# EAGLE design EIB 2xA79026-001 large pins v1.2 (EAGLE 6.5.0)
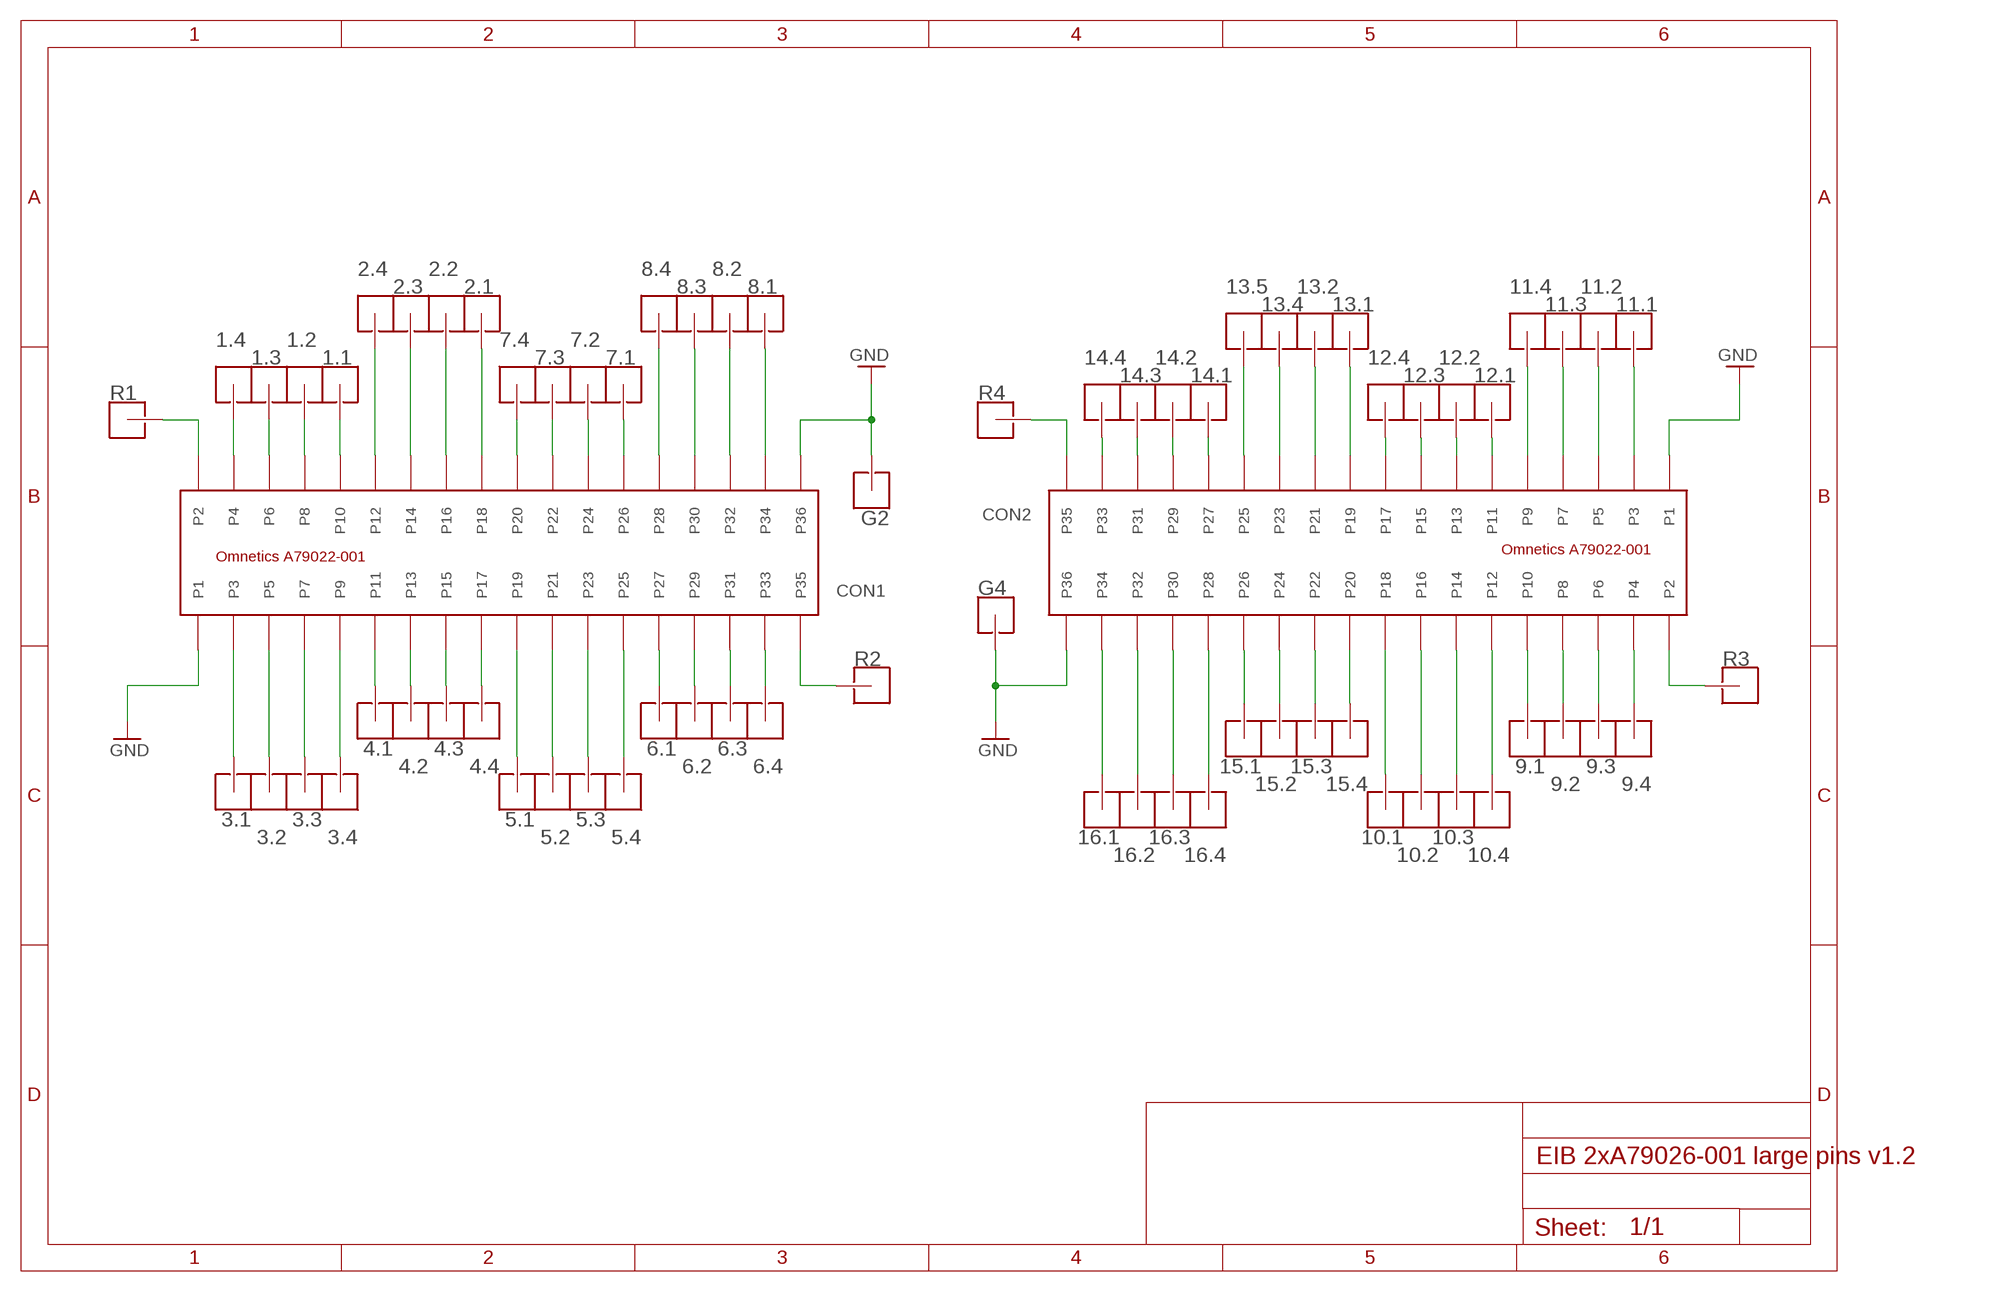
[diagram p0: schematic, sheet 1]

## Parts
1.1  HOLE_L_G_PIN_V5  [LARGE_GOLD_PIN_V5]
1.2  HOLE_L_G_PIN_V5  [LARGE_GOLD_PIN_V5]
1.3  HOLE_L_G_PIN_V5  [LARGE_GOLD_PIN_V5]
1.4  HOLE_L_G_PIN_V5  [LARGE_GOLD_PIN_V5]
2.1  HOLE_L_G_PIN_V5  [LARGE_GOLD_PIN_V5]
2.2  HOLE_L_G_PIN_V5  [LARGE_GOLD_PIN_V5]
2.3  HOLE_L_G_PIN_V5  [LARGE_GOLD_PIN_V5]
2.4  HOLE_L_G_PIN_V5  [LARGE_GOLD_PIN_V5]
3.1  HOLE_L_G_PIN_V5  [LARGE_GOLD_PIN_V5]
3.2  HOLE_L_G_PIN_V5  [LARGE_GOLD_PIN_V5]
3.3  HOLE_L_G_PIN_V5  [LARGE_GOLD_PIN_V5]
3.4  HOLE_L_G_PIN_V5  [LARGE_GOLD_PIN_V5]
4.1  HOLE_L_G_PIN_V5  [LARGE_GOLD_PIN_V5]
4.2  HOLE_L_G_PIN_V5  [LARGE_GOLD_PIN_V5]
4.3  HOLE_L_G_PIN_V5  [LARGE_GOLD_PIN_V5]
4.4  HOLE_L_G_PIN_V5  [LARGE_GOLD_PIN_V5]
5.1  HOLE_L_G_PIN_V5  [LARGE_GOLD_PIN_V5]
5.2  HOLE_L_G_PIN_V5  [LARGE_GOLD_PIN_V5]
5.3  HOLE_L_G_PIN_V5  [LARGE_GOLD_PIN_V5]
5.4  HOLE_L_G_PIN_V5  [LARGE_GOLD_PIN_V5]
6.1  HOLE_L_G_PIN_V5  [LARGE_GOLD_PIN_V5]
6.2  HOLE_L_G_PIN_V5  [LARGE_GOLD_PIN_V5]
6.3  HOLE_L_G_PIN_V5  [LARGE_GOLD_PIN_V5]
6.4  HOLE_L_G_PIN_V5  [LARGE_GOLD_PIN_V5]
7.1  HOLE_L_G_PIN_V5  [LARGE_GOLD_PIN_V5]
7.2  HOLE_L_G_PIN_V5  [LARGE_GOLD_PIN_V5]
7.3  HOLE_L_G_PIN_V5  [LARGE_GOLD_PIN_V5]
7.4  HOLE_L_G_PIN_V5  [LARGE_GOLD_PIN_V5]
8.1  HOLE_L_G_PIN_V5  [LARGE_GOLD_PIN_V5]
8.2  HOLE_L_G_PIN_V5  [LARGE_GOLD_PIN_V5]
8.3  HOLE_L_G_PIN_V5  [LARGE_GOLD_PIN_V5]
8.4  HOLE_L_G_PIN_V5  [LARGE_GOLD_PIN_V5]
9.1  HOLE_L_G_PIN_V5  [LARGE_GOLD_PIN_V5]
9.2  HOLE_L_G_PIN_V5  [LARGE_GOLD_PIN_V5]
9.3  HOLE_L_G_PIN_V5  [LARGE_GOLD_PIN_V5]
9.4  HOLE_L_G_PIN_V5  [LARGE_GOLD_PIN_V5]
10.1  HOLE_L_G_PIN_V5  [LARGE_GOLD_PIN_V5]
10.2  HOLE_L_G_PIN_V5  [LARGE_GOLD_PIN_V5]
10.3  HOLE_L_G_PIN_V5  [LARGE_GOLD_PIN_V5]
10.4  HOLE_L_G_PIN_V5  [LARGE_GOLD_PIN_V5]
11.1  HOLE_L_G_PIN_V5  [LARGE_GOLD_PIN_V5]
11.2  HOLE_L_G_PIN_V5  [LARGE_GOLD_PIN_V5]
11.3  HOLE_L_G_PIN_V5  [LARGE_GOLD_PIN_V5]
11.4  HOLE_L_G_PIN_V5  [LARGE_GOLD_PIN_V5]
12.1  HOLE_L_G_PIN_V5  [LARGE_GOLD_PIN_V5]
12.2  HOLE_L_G_PIN_V5  [LARGE_GOLD_PIN_V5]
12.3  HOLE_L_G_PIN_V5  [LARGE_GOLD_PIN_V5]
12.4  HOLE_L_G_PIN_V5  [LARGE_GOLD_PIN_V5]
13.1  HOLE_L_G_PIN_V5  [LARGE_GOLD_PIN_V5]
13.2  HOLE_L_G_PIN_V5  [LARGE_GOLD_PIN_V5]
13.4  HOLE_L_G_PIN_V5  [LARGE_GOLD_PIN_V5]
13.5  HOLE_L_G_PIN_V5  [LARGE_GOLD_PIN_V5]
14.1  HOLE_L_G_PIN_V5  [LARGE_GOLD_PIN_V5]
14.2  HOLE_L_G_PIN_V5  [LARGE_GOLD_PIN_V5]
14.3  HOLE_L_G_PIN_V5  [LARGE_GOLD_PIN_V5]
14.4  HOLE_L_G_PIN_V5  [LARGE_GOLD_PIN_V5]
15.1  HOLE_L_G_PIN_V5  [LARGE_GOLD_PIN_V5]
15.2  HOLE_L_G_PIN_V5  [LARGE_GOLD_PIN_V5]
15.3  HOLE_L_G_PIN_V5  [LARGE_GOLD_PIN_V5]
15.4  HOLE_L_G_PIN_V5  [LARGE_GOLD_PIN_V5]
16.1  HOLE_L_G_PIN_V5  [LARGE_GOLD_PIN_V5]
16.2  HOLE_L_G_PIN_V5  [LARGE_GOLD_PIN_V5]
16.3  HOLE_L_G_PIN_V5  [LARGE_GOLD_PIN_V5]
16.4  HOLE_L_G_PIN_V5  [LARGE_GOLD_PIN_V5]
CON1  A79022-001_MALESMD  [A79026-001_MALE]
CON2  A79022-001_MALESMD  [A79026-001_MALE]
G2  HOLE_L_G_PIN_V5  [LARGE_GOLD_PIN_V5]
G4  HOLE_L_G_PIN_V5  [LARGE_GOLD_PIN_V5]
R1  HOLE_L_G_PIN_V5  [LARGE_GOLD_PIN_V5]
R2  HOLE_L_G_PIN_V5  [LARGE_GOLD_PIN_V5]
R3  HOLE_L_G_PIN_V5  [LARGE_GOLD_PIN_V5]
R4  HOLE_L_G_PIN_V5  [LARGE_GOLD_PIN_V5]

## Nets
GND: CON1.P1 CON1.P36 CON2.P1 CON2.P36 G2.P$1 G4.P$1
N$1: 11.2.P$1 CON2.P5
N$2: 11.3.P$1 CON2.P7
N$3: 11.4.P$1 CON2.P9
N$4: 14.4.P$1 CON2.P33
N$5: 16.2.P$1 CON2.P32
N$6: 16.1.P$1 CON2.P34
N$7: 12.1.P$1 CON2.P11
N$8: 16.3.P$1 CON2.P30
N$9: 12.4.P$1 CON2.P17
N$10: 13.1.P$1 CON2.P19
N$11: 15.4.P$1 CON2.P20
N$12: 10.4.P$1 CON2.P12
N$13: 12.2.P$1 CON2.P13
N$14: 12.3.P$1 CON2.P15
N$15: 13.2.P$1 CON2.P21
N$16: 13.4.P$1 CON2.P23
N$17: 13.5.P$1 CON2.P25
N$18: 14.1.P$1 CON2.P27
N$19: 14.2.P$1 CON2.P29
N$20: 14.3.P$1 CON2.P31
N$21: 10.1.P$1 CON2.P18
N$22: 11.1.P$1 CON2.P3
N$23: 9.4.P$1 CON2.P4
N$24: 9.3.P$1 CON2.P6
N$25: 9.2.P$1 CON2.P8
N$26: 10.3.P$1 CON2.P14
N$27: 10.2.P$1 CON2.P16
N$28: 9.1.P$1 CON2.P10
N$29: 16.4.P$1 CON2.P28
N$30: 15.1.P$1 CON2.P26
N$31: 15.3.P$1 CON2.P22
N$32: 15.2.P$1 CON2.P24
N$33: CON1.P2 R1.P$1
N$34: CON2.P2 R3.P$1
N$35: CON2.P35 R4.P$1
N$36: CON1.P35 R2.P$1
N$37: 3.2.P$1 CON1.P5
N$38: 3.3.P$1 CON1.P7
N$39: 3.4.P$1 CON1.P9
N$40: 4.1.P$1 CON1.P11
N$41: 4.2.P$1 CON1.P13
N$42: 4.3.P$1 CON1.P15
N$43: 5.2.P$1 CON1.P21
N$44: 5.3.P$1 CON1.P23
N$45: 5.4.P$1 CON1.P25
N$46: 7.4.P$1 CON1.P20
N$47: 7.3.P$1 CON1.P22
N$48: 7.2.P$1 CON1.P24
N$49: 4.4.P$1 CON1.P17
N$50: 5.1.P$1 CON1.P19
N$51: 7.1.P$1 CON1.P26
N$52: 2.1.P$1 CON1.P18
N$53: 3.1.P$1 CON1.P3
N$54: 1.4.P$1 CON1.P4
N$55: 1.3.P$1 CON1.P6
N$56: 1.2.P$1 CON1.P8
N$57: 2.4.P$1 CON1.P12
N$58: 2.3.P$1 CON1.P14
N$59: 2.2.P$1 CON1.P16
N$60: 1.1.P$1 CON1.P10
N$61: 6.4.P$1 CON1.P33
N$62: 6.1.P$1 CON1.P27
N$63: 6.2.P$1 CON1.P29
N$64: 6.3.P$1 CON1.P31
N$65: 8.1.P$1 CON1.P34
N$66: 8.2.P$1 CON1.P32
N$67: 8.3.P$1 CON1.P30
N$68: 8.4.P$1 CON1.P28

## Library data of the parts
1.1-1.4 2.1-2.4 3.1-3.4 4.1-4.4 5.1-5.4 6.1-6.4 7.1-7.4 8.1-8.4 9.1-9.4 10.1-10.4 11.1-11.4 12.1-12.4 13.1 13.2 13.4 13.5 14.1-14.4 15.1-15.4 16.1-16.4 G2 G4 R1-R4 = pin and holes:HOLE
CON1 CON2 = omnetics:A79022-001_MALE

## Board
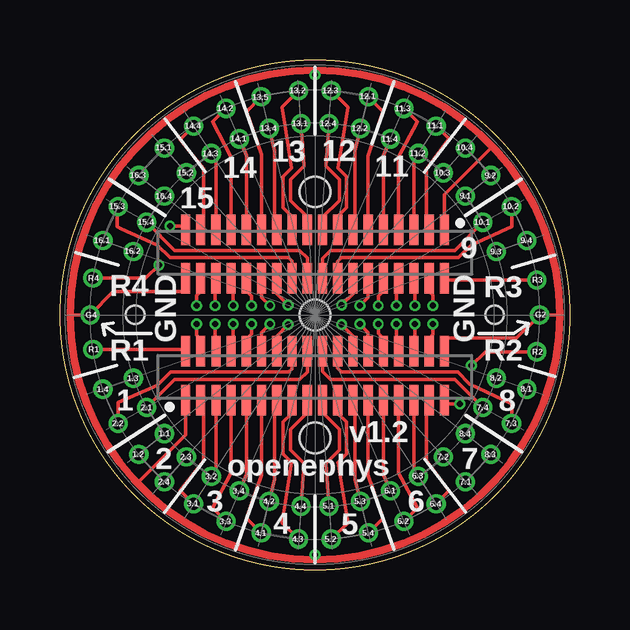
[diagram p1: board, top side]
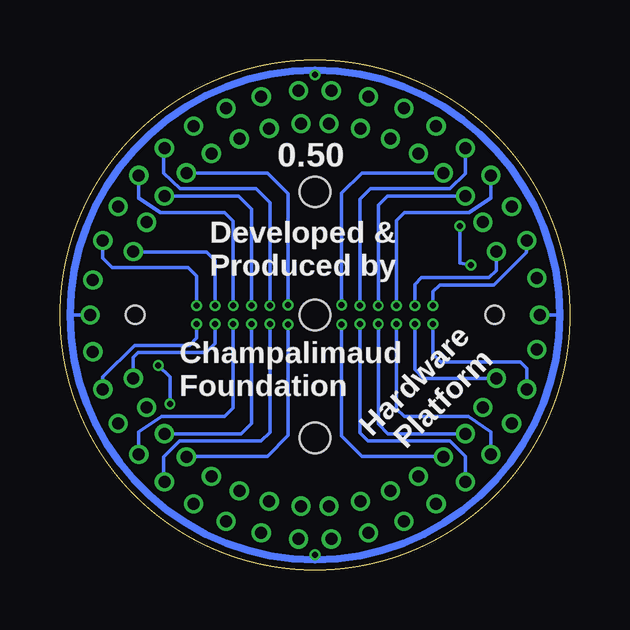
[diagram p2: board, bottom side, seen from below]

Size 21.26 x 21.26 mm. Coordinates in mm from the lower left corner, seen from the top.
Outline: circle at 10.63,10.63 radius 10.63
Copper layers (1*16): Top 0.012mm / dielectric 1.55mm / Bottom 0.012mm
Design rules "eC_2Layer_PClass8_BaseCopperO12 CHANGED": minimum track width 0.1mm, minimum drill 0.2mm, track to track 0.1mm, track to pad 0.1mm, pad to pad 0.1mm, via to via 0.1mm, smd to smd 0mil, copper to edge 0.25mm, drill to drill 0.35mm, minimum pad ring 0.1mm, minimum via ring 0.1mm, stop-mask expansion 0mil, vias tented up to drill 0.45mm, thermal gap 0.2mm
Holes 1.27 mm at 10.63,10.63 10.63,15.76 10.63,5.5
Holes 0.76 mm at 3.14,10.63 18.12,10.63

### Footprints (pad centres in the part's own frame; a part is rotated, then mirrored left to right if it is on the bottom)
LARGE_GOLD_PIN_V5 = drill 0.5 pad 0.8: P$1 0,0
A79026-001_MALE = smd 0.381 x 1.27: P1 -5.397,-1.016; P2 -5.397,1.016; P3 -4.763,-1.016; P4 -4.763,1.016; P5 -4.128,-1.016; P6 -4.128,1.016; P7 -3.493,-1.016; P8 -3.493,1.016; P9 -2.857,-1.016; P10 -2.857,1.016; P11 -2.223,-1.016; P12 -2.223,1.016; P13 -1.587,-1.016; P14 -1.587,1.016; P15 -0.953,-1.016; P16 -0.953,1.016; P17 -0.318,-1.016; P18 -0.318,1.016; P19 0.318,-1.016; P20 0.318,1.016; P21 0.953,-1.016; P22 0.953,1.016; P23 1.587,-1.016; P24 1.587,1.016; P25 2.223,-1.016; P26 2.223,1.016; P27 2.857,-1.016; P28 2.857,1.016; P29 3.493,-1.016; P30 3.493,1.016; P31 4.128,-1.016; P32 4.128,1.016; P33 4.763,-1.016; P34 4.763,1.016; P35 5.397,-1.016; P36 5.397,1.016

### Placement (x,y rotation side)
1.1  4.36,5.68 0 top
1.2  3.29,4.81 0 top
1.3  3.06,7.99 0 top
1.4  1.79,7.53 0 top
2.1  3.62,6.77 0 top
2.2  2.43,6.11 0 top
2.3  5.27,4.71 0 top
2.4  4.36,3.67 0 top
3.1  5.58,2.76 0 top
3.2  6.31,3.9 0 top
3.3  6.92,2.02 0 top
3.4  7.48,3.29 0 top
4.1  8.4,1.54 0 top
4.2  8.73,2.86 0 top
4.3  9.94,1.28 0 top
4.4  10.05,2.65 0 top
5.1  11.21,2.65 0 top
5.2  11.32,1.28 0 top
5.3  12.54,2.86 0 top
5.4  12.87,1.54 0 top
6.1  13.78,3.29 0 top
6.2  14.34,2.02 0 top
6.3  14.95,3.9 0 top
6.4  15.69,2.76 0 top
7.1  16.9,3.67 0 top
7.2  15.99,4.71 0 top
7.3  18.83,6.11 0 top
7.4  17.64,6.77 0 top
8.1  19.47,7.53 0 top
8.2  18.2,7.99 0 top
8.3  17.97,4.81 0 top
8.4  16.9,5.68 0 top
9.1  16.9,15.58 0 top
9.2  17.97,16.45 0 top
9.3  18.2,13.27 0 top
9.4  19.47,13.73 0 top
10.1  17.64,14.49 0 top
10.2  18.83,15.15 0 top
10.3  15.99,16.55 0 top
10.4  16.9,17.59 0 top
11.1  15.69,18.5 0 top
11.2  14.95,17.36 0 top
11.3  14.34,19.24 0 top
11.4  13.78,17.97 0 top
12.1  12.87,19.72 0 top
12.2  12.54,18.4 0 top
12.3  11.32,19.98 0 top
12.4  11.21,18.61 0 top
13.1  10.05,18.61 0 top
13.2  9.94,19.98 0 top
13.4  8.73,18.4 0 top
13.5  8.4,19.72 0 top
14.1  7.48,17.97 0 top
14.2  6.92,19.24 0 top
14.3  6.31,17.36 0 top
14.4  5.58,18.5 0 top
15.1  4.36,17.59 0 top
15.2  5.27,16.55 0 top
15.3  2.43,15.15 0 top
15.4  3.62,14.49 0 top
16.1  1.79,13.73 0 top
16.2  3.06,13.27 0 top
16.3  3.29,16.45 0 top
16.4  4.36,15.58 0 top
CON1  10.63,8.09 0 top
CON2  10.63,13.17 180 top
G2  20,10.63 0 top
G4  1.26,10.63 0 top
R1  1.37,9.18 0 top
R2  19.89,9.09 0 top
R3  19.89,12.08 0 top
R4  1.37,12.17 0 top

### Tracks (layer width: path | path; a pad name or v marks a point on that pad's centre or on a via)
GND  (via drill 0.25)
  Top 0.152: CON1.P1 5.25,7.06 5.25,5.63 3.24,3.62 3.21,3.62 2.2,4.84 1.33,6.41 0.93,7.53 0.52,8.85 0.41,10.63 G4.P$1 2.22,11.6 5.25,11.6 5.25,12.14 CON2.P36 | CON2.P1 16.03,15.65 18.05,17.67 18.96,16.52 19.88,15 20.43,13.47 20.79,12.05 20.84,10.63 G2.P$1 19.04,9.66 16.01,9.66 16.03,9.65 CON1.P36 | v10.63,20.64 10.63,20.84 | v10.63,0.62 10.63,0.42
  Top 0.305: 0.42,10.63 arc-90 10.63,20.84 arc-90 20.84,10.63 arc-90 10.63,0.42 arc-90 0.42,10.63
  Bottom 0.152: 20.84,10.63 G2.P$1 | G4.P$1 0.42,10.63
  Bottom 0.305: 0.42,10.63 arc-90 10.63,20.84 arc-90 20.84,10.63 arc-90 10.63,0.42 arc-90 0.42,10.63
N$1
  Top 0.152: CON2.P5 14.76,17.17 11.2.P$1
N$2
  Top 0.152: CON2.P7 14.12,17.21 14.9,18.68 11.3.P$1
N$3
  Top 0.152: CON2.P9 13.49,17.27 11.4.P$1
N$4
  Top 0.152: CON2.P33 5.98,14.3 5.98,16.73 5.02,17.95 14.4.P$1
N$5  (via drill 0.25)
  Top 0.152: CON2.P32 6.46,12.12 v6.46,11.01
  Bottom 0.152: 3.09,13.25 16.2.P$1 3.06,12.48 3.37,12.18 6.19,12.18 6.46,11.9 v6.46,11.01
N$6  (via drill 0.25)
  Top 0.152: CON2.P34 5.87,11.61 5.7,11.44 v5.7,11.01
  Bottom 0.152: 16.1.P$1 1.82,13.7 1.82,13.22 3.16,11.87 5.42,11.87 5.7,11.6 v5.7,11.01
N$7
  Top 0.152: CON2.P11 12.85,17.26 13.47,19.11 12.1.P$1
N$8  (via drill 0.25)
  Top 0.152: CON2.P30 7.23,12.06 v7.23,11.01
  Bottom 0.152: v7.23,11.01 7.23,14.57 6.9,14.9 4.2,14.9 3.29,15.51 16.3.P$1
N$9
  Top 0.152: CON2.P17 10.95,14.71 11.65,15.41 11.65,16.27 11.09,16.83 12.4.P$1
N$10
  Top 0.152: CON2.P19 10.31,14.71 9.61,15.41 9.61,16.27 10.17,16.83 13.1.P$1
N$11
  Top 0.152: CON2.P20 10.31,13.01 10,13.32 4.79,13.32 15.4.P$1
N$12  (via drill 0.25)
  Top 0.152: CON2.P12 12.85,11.35 v12.51,11.01
  Bottom 0.152: v12.51,11.01 12.51,15.3 13.09,15.89 16.24,15.89 16.93,16.55 16.93,17.56 10.4.P$1
N$13
  Top 0.152: CON2.P13 12.31,14.19 12.31,17.49 12.2.P$1
N$14
  Top 0.152: CON2.P15 11.58,14.73 11.95,15.1 11.95,16.4 11.6,16.75 11.87,18.53 12,19.29 12.3.P$1
N$15
  Top 0.152: CON2.P21 9.68,14.73 9.31,15.1 9.31,16.4 9.66,16.75 9.39,18.53 9.26,19.29 13.2.P$1
N$16
  Top 0.152: CON2.P23 8.95,14.19 8.95,17.49 13.4.P$1
N$17
  Top 0.152: CON2.P25 8.41,17.31 7.79,19.11 13.5.P$1
N$18
  Top 0.152: CON2.P27 7.77,17.27 14.1.P$1
N$19
  Top 0.152: CON2.P29 7.14,17.21 6.36,18.68 14.2.P$1
N$20
  Top 0.152: CON2.P31 6.5,17.17 14.3.P$1
N$21
  Top 0.152: CON2.P18 10.95,12.98 11.29,13.32 16.47,13.32 10.1.P$1
N$22
  Top 0.152: CON2.P3 15.28,14.3 15.28,16.7 16.22,17.97 11.1.P$1
N$23  (via drill 0.25)
  Top 0.152: CON2.P4 15.39,11.63 15.56,11.47 v15.56,11.01
  Bottom 0.152: v15.56,11.01 15.56,12.26 15.91,12.61 19.09,12.61 19.47,12.99 9.4.P$1
N$24  (via drill 0.25)
  Top 0.152: CON2.P6 14.8,12.12 v14.8,11.01
  Bottom 0.152: v14.8,11.01 14.8,12.89 15.15,13.25 18.1,13.25 9.3.P$1
N$25  (via drill 0.25)
  Top 0.152: CON2.P8 14.03,12.07 v14.03,11.01
  Bottom 0.152: v14.03,11.01 14.03,14.54 14.39,14.9 17.06,14.9 17.97,15.51 9.2.P$1
N$26  (via drill 0.25)
  Top 0.152: CON2.P14 12.22,11.51 v11.75,11.04
  Bottom 0.152: v11.75,11.04 11.75,15.68 12.61,16.55 10.3.P$1
N$27
  Top 0.152: CON2.P16 11.58,12.85 11.75,13.02 16.62,13.02 17.16,13.55 18.83,14.31 10.2.P$1
N$28  (via drill 0.25)
  Top 0.152: CON2.P10 13.49,11.63 13.27,11.42 v13.27,11.01
  Bottom 0.152: v13.27,11.01 13.27,15.05 13.81,15.58 9.1.P$1
N$29  (via drill 0.25)
  Top 0.152: CON2.P28 7.77,11.63 7.99,11.42 v7.99,11.01
  Bottom 0.152: v7.99,11.01 7.99,15.2 7.61,15.58 16.4.P$1
N$30  (via drill 0.25)
  Top 0.152: CON2.P26 8.41,11.35 v8.75,11.01
  Bottom 0.152: v8.75,11.01 8.75,15.46 8.32,15.89 4.99,15.89 4.36,16.52 15.1.P$1
N$31
  Top 0.152: CON2.P22 9.68,12.88 9.54,13.02 4.58,13.02 4.05,13.55 2.53,14.24 2.38,14.31 2.38,15.15 15.3.P$1
N$32  (via drill 0.25)
  Top 0.152: CON2.P24 9.04,11.51 v9.51,11.04
  Bottom 0.152: v9.51,11.04 9.51,15.71 8.67,16.55 15.2.P$1
N$33
  Top 0.152: R1.P$1 5.16,9.18 arc-90 CON1.P2
N$34
  Top 0.152: R3.P$1 16.1,12.08 arc-90 CON2.P2
N$35  (via drill 0.25)
  Top 0.152: CON2.P35 5.23,14.34 v4.58,14.34 | v4.13,12.71 3.58,12.17 R4.P$1
  Bottom 0.152: v4.58,14.34 4.58,12.79 v4.13,12.71
N$36  (via drill 0.25)
  Top 0.152: CON1.P35 16.03,6.92 v16.68,6.92 | v17.16,8.52 17.73,9.09 R2.P$1
  Bottom 0.152: v16.68,6.92 16.68,8.04 v17.16,8.52
N$37
  Top 0.152: CON1.P5 6.5,4.09 3.2.P$1
N$38
  Top 0.152: CON1.P7 7.14,4.05 6.36,2.58 3.3.P$1
N$39
  Top 0.152: CON1.P9 7.77,3.98 3.4.P$1
N$40
  Top 0.152: CON1.P11 8.41,3.95 7.79,2.15 4.1.P$1
N$41
  Top 0.152: CON1.P13 8.95,6.99 8.95,3.77 4.2.P$1
N$42
  Top 0.152: CON1.P15 9.68,6.53 9.31,6.16 9.31,4.84 9.66,4.48 9.39,2.73 arc3 9.26,1.97 4.3.P$1
N$43
  Top 0.152: CON1.P21 11.58,6.53 11.95,6.16 11.95,4.84 11.6,4.48 11.87,2.73 12,1.97 5.2.P$1
N$44
  Top 0.152: CON1.P23 12.31,6.99 12.31,3.77 5.3.P$1
N$45
  Top 0.152: CON1.P25 12.85,3.95 13.47,2.15 5.4.P$1
N$46
  Top 0.152: CON1.P20 10.95,8.28 11.29,7.94 16.47,7.94 7.4.P$1
N$47
  Top 0.152: CON1.P22 11.58,8.41 11.75,8.24 16.6,8.24 17.08,7.76 18.83,6.92 7.3.P$1
N$48  (via drill 0.25)
  Top 0.152: CON1.P24 12.22,9.75 v11.75,10.22
  Bottom 0.152: v11.75,10.22 11.75,5.6 12.61,4.74 15.96,4.74 7.2.P$1
N$49
  Top 0.152: CON1.P17 10.31,6.55 9.61,5.85 9.61,4.99 10.17,4.43 4.4.P$1
N$50
  Top 0.152: CON1.P19 10.95,6.55 11.65,5.85 11.65,4.99 11.09,4.43 5.1.P$1
N$51  (via drill 0.25)
  Top 0.152: CON1.P26 12.85,9.91 v12.51,10.25
  Bottom 0.152: v12.51,10.25 12.51,5.73 12.87,5.37 16.27,5.37 16.93,4.71 16.93,3.7 7.1.P$1
N$52
  Top 0.152: CON1.P18 10.31,8.26 10,7.94 4.79,7.94 2.1.P$1
N$53
  Top 0.152: CON1.P3 5.98,6.96 5.98,4.53 5.02,3.31 3.1.P$1
N$54  (via drill 0.25)
  Top 0.152: CON1.P4 5.87,9.63 5.7,9.79 v5.7,10.25
  Bottom 0.152: v5.7,10.25 5.7,9 5.37,8.67 2.07,8.67 1.79,8.39 1.4.P$1
N$55  (via drill 0.25)
  Top 0.152: CON1.P6 6.46,9.14 v6.46,10.25
  Bottom 0.152: v6.46,10.25 6.46,8.34 6.11,7.99 1.3.P$1
N$56  (via drill 0.25)
  Top 0.152: CON1.P8 7.23,9.2 v7.23,10.25
  Bottom 0.152: v7.23,10.25 7.23,6.72 6.9,6.39 4.23,6.39 3.29,5.75 1.2.P$1
N$57  (via drill 0.25)
  Top 0.152: CON1.P12 8.41,9.91 v8.75,10.25
  Bottom 0.152: v8.75,10.25 8.75,5.7 8.42,5.37 4.99,5.37 4.36,4.74 2.4.P$1
N$58  (via drill 0.25)
  Top 0.152: CON1.P14 9.04,9.75 v9.51,10.22
  Bottom 0.152: v9.51,10.22 9.51,5.58 8.67,4.74 5.3,4.74 2.3.P$1
N$59
  Top 0.152: CON1.P16 9.68,8.38 9.54,8.24 4.61,8.24 4.05,7.68 2.43,6.97 2.2.P$1
N$60  (via drill 0.25)
  Top 0.152: CON1.P10 7.77,9.63 7.99,9.84 v7.99,10.25
  Bottom 0.152: v7.99,10.25 7.99,6.08 7.58,5.68 1.1.P$1
N$61
  Top 0.152: CON1.P33 15.28,6.96 15.28,4.56 16.22,3.29 6.4.P$1
N$62
  Top 0.152: CON1.P27 13.49,3.96 6.1.P$1
N$63
  Top 0.152: CON1.P29 14.12,4.05 14.9,2.58 6.2.P$1
N$64
  Top 0.152: CON1.P31 14.76,4.09 6.3.P$1
N$65  (via drill 0.25)
  Top 0.152: CON1.P34 15.39,9.65 15.56,9.82 v15.56,10.25
  Bottom 0.152: 8.1.P$1 19.47,8.04 18.15,9.36 15.86,9.36 15.56,9.66 v15.56,10.25
N$66  (via drill 0.25)
  Top 0.152: 14.8,9.11 CON1.P32 14.8,9.14 v14.8,10.25
  Bottom 0.152: v14.8,10.25 14.8,9.44 15.18,9.06 18,9.06 18.2,8.85 8.2.P$1
N$67  (via drill 0.25)
  Top 0.152: 14.03,9.11 CON1.P30 14.03,9.2 v14.03,10.25
  Bottom 0.152: v14.03,10.25 14.03,6.74 14.39,6.39 17.03,6.39 17.97,5.75 8.3.P$1
N$68  (via drill 0.25)
  Top 0.152: CON1.P28 13.49,9.64 13.27,9.86 v13.27,10.25
  Bottom 0.152: v13.27,10.25 13.27,6.11 13.7,5.68 8.4.P$1

### Text on the board
tPlace: 13 | 12 | 14 | 11 | 15 | 9 | R4 | R3 | R1 | GND | GND | R2 | 1 | 8 | v1.2 | 2 | openephys | 7 | 3 | 6 | 4 | 5
bPlace: 0.50 | Developed & / Produced by | Hardware / Platform | Champalimaud / Foundation